# EAGLE design GatorParticle (EAGLE 9.1.0)
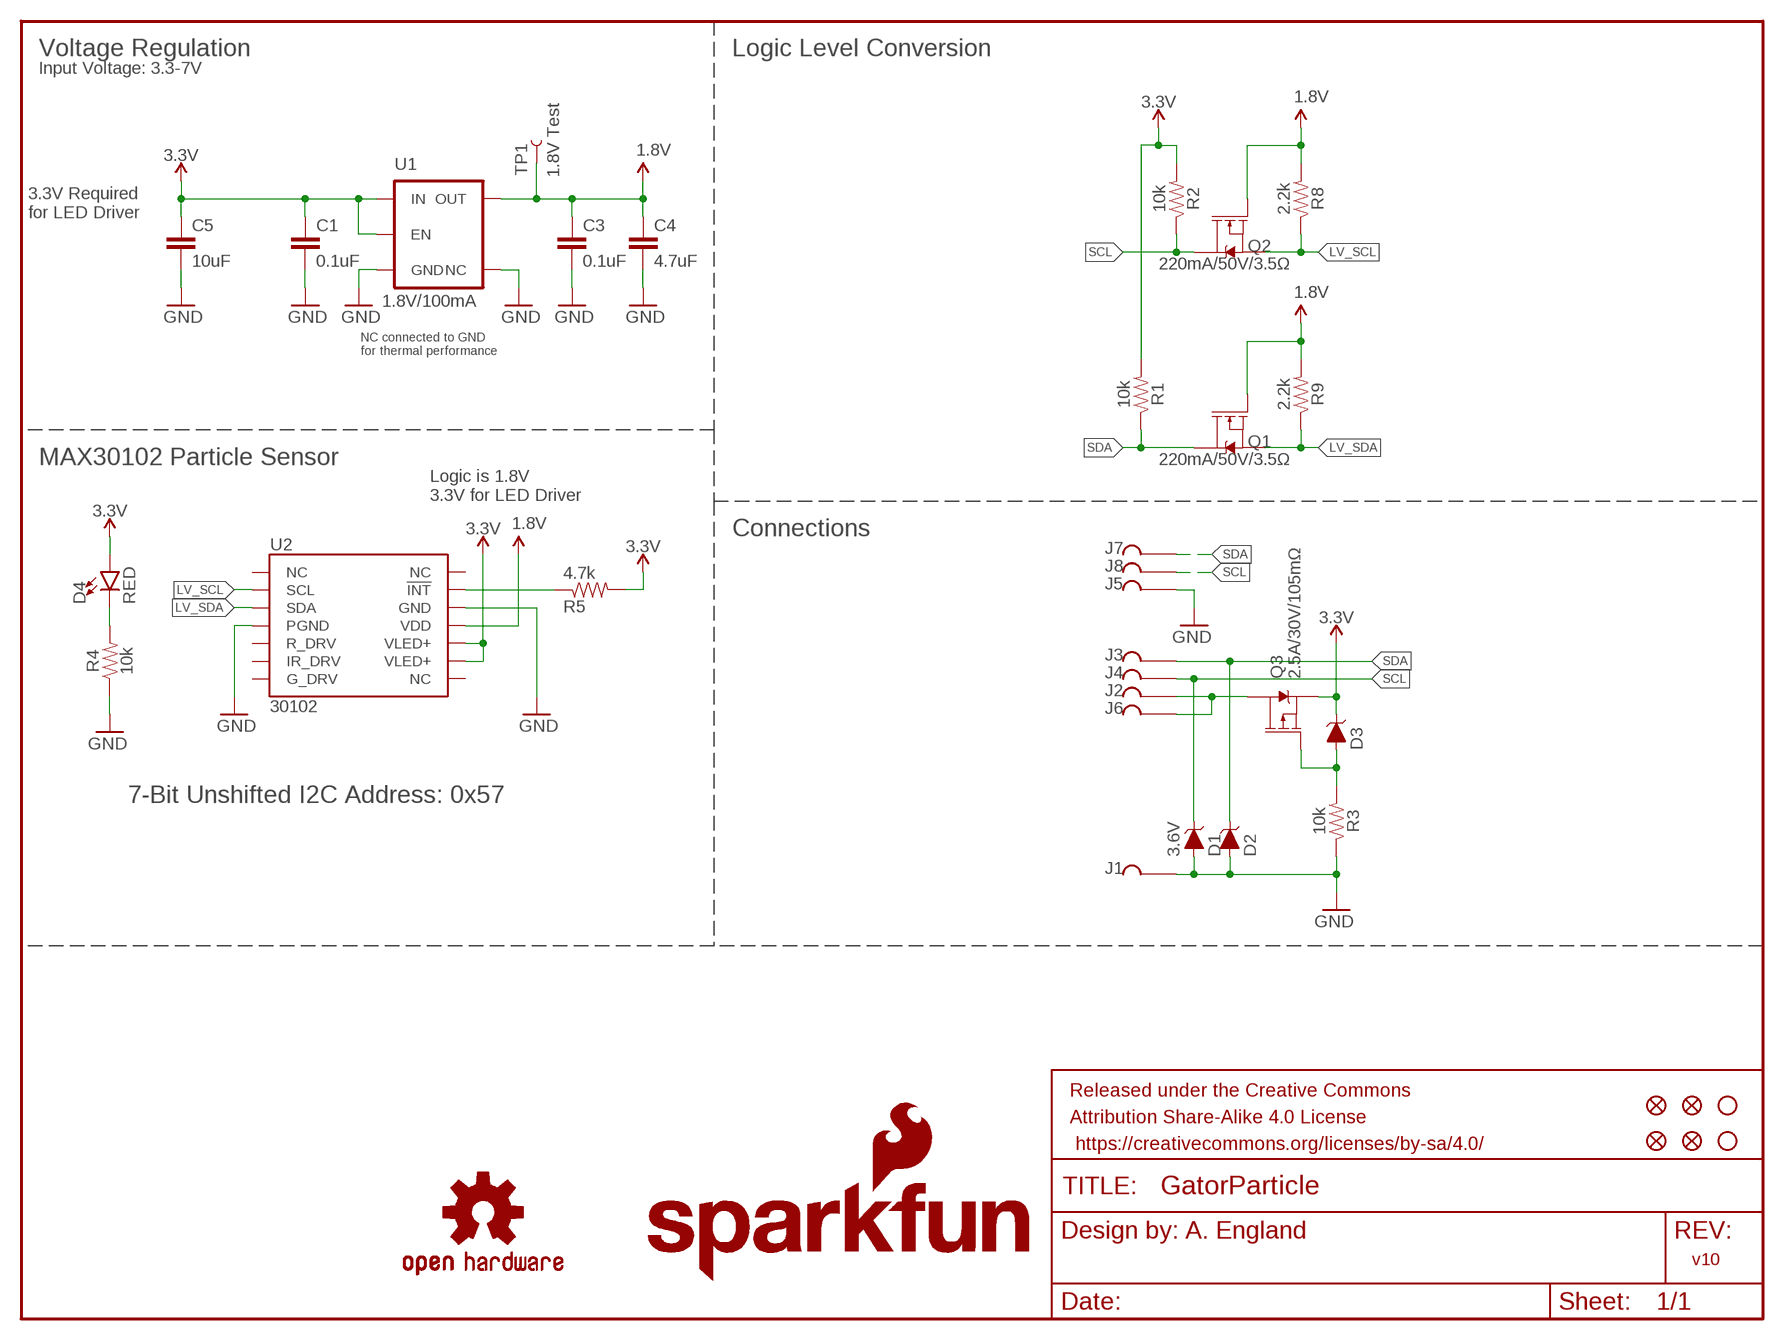
[diagram p0: schematic, sheet 1]

## Parts
C1  0.1uF  0.1UF-0603-25V-(+80/-20%)  [0603]
C3  0.1uF  0.1UF-0603-25V-(+80/-20%)  [0603]
C4  4.7uF  4.7UF-0603-6.3V-(10%)  [0603]
C5  10uF  10UF-0603-6.3V-20%  [0603]
D1  3.6V  DIODE-ZENER-BZT52C3V6S  [SOD-323]
D2  3.6V  DIODE-ZENER-BZT52C3V6S  [SOD-323]
D3  3.6V  DIODE-ZENER-BZT52C3V6S  [SOD-323]
D4  RED  LED-RED0603  [LED-0603]
FID1  FIDUCIALUFIDUCIAL  [FIDUCIAL-MICRO]
FID2  FIDUCIALUFIDUCIAL  [FIDUCIAL-MICRO]
FID3  FIDUCIALUFIDUCIAL  [FIDUCIAL-MICRO]
FID4  FIDUCIALUFIDUCIAL  [FIDUCIAL-MICRO]
FRAME1  FRAME-LETTER  [CREATIVE_COMMONS]
J1  GATORGATOR_MINI  [GATOR_MINI]
J2  GATORGATOR_MINI  [GATOR_MINI]
J3  GATORGATOR_MINI  [GATOR_MINI]
J4  GATORGATOR_MINI  [GATOR_MINI]
J5  GATORGATOR_MINI  [GATOR_MINI]
J6  GATORGATOR_MINI  [GATOR_MINI]
J7  GATORGATOR_MINI  [GATOR_MINI]
J8  GATORGATOR_MINI  [GATOR_MINI]
LOGO1  SFE_LOGO_NAME_FLAME.1_INCH  [SFE_LOGO_NAME_FLAME_.1]
LOGO2  OSHW-LOGOS  [OSHW-LOGO-S]
Q1  220mA/50V/3.5Ω  MOSFET-NCH-BSS138  [SOT23-3]
Q2  220mA/50V/3.5Ω  MOSFET-NCH-BSS138  [SOT23-3]
Q3  2.5A/30V/105mΩ  MOSFET_PCH-DMG2307L  [SOT23-3]
R1  10k  10KOHM-0603-1/10W-1%  [0603]
R2  10k  10KOHM-0603-1/10W-1%  [0603]
R3  10k  10KOHM-0603-1/10W-1%  [0603]
R4  10k  10KOHM-0603-1/10W-1%  [0603]
R5  4.7k  4.7KOHM-0603-1/10W-1%  [0603]
R8  2.2k  2.2KOHM-0603-1/10W-1%  [0603]
R9  2.2k  2.2KOHM-0603-1/10W-1%  [0603]
STANDOFF2  STAND-OFFTIGHT  [STAND-OFF-TIGHT]
STANDOFF3  STAND-OFFTIGHT  [STAND-OFF-TIGHT]
TP1  1.8V Test  TEST-POINT3X4  [PAD.03X.04]
U1  1.8V/100mA  V_REG_SP6214-1.8V  [SC70]
U2  30102  MAX3010X-30102  [OLGA-14]

## Nets
1.8V: C3.1 C4.1 Q1.1(G) Q2.1(G) R8.2 R9.2 TP1.P$1 U1.5(OUT) U2.11(VDD)
3.3V: C1.1 C5.1 D3.C D4.A Q3.2(S) R1.2 R2.2 R5.2 U1.1(IN) U1.3(EN) U2.9(VLED+) U2.10(VLED+)
!INT: R5.1 U2.13(!INT)
GND [power]: C1.2 C3.2 C4.2 C5.2 D1.A D2.A J1.P$2 J5.P$2 R3.1 R4.1 U1.2(GND) U1.4(NC) U2.4(PGND) U2.12(GND)
LV_SCL: Q2.2(S) R8.1 U2.2(SCL)
LV_SDA: Q1.2(S) R9.1 U2.3(SDA)
N$1 [power]: D3.A Q3.1(G) R3.2
N$2: J2.P$2 J6.P$2 Q3.3(D)
N$3: D4.C R4.2
SCL: D1.C J4.P$2 J8.P$2 Q2.3(D) R2.1
SDA: D2.C J3.P$2 J7.P$2 Q1.3(D) R1.1
Unconnected: U2.1(NC) U2.5(R_DRV) U2.6(IR_DRV) U2.7(G_DRV) U2.8(NC) U2.14(NC)

## Notes on the sheet
- Voltage Regulation | Logic Level Conversion
- Input Voltage: 3.3-7V
- 3.3V Required
  for LED Driver
- NC connected to GND
  for thermal performance
- MAX30102 Particle Sensor
- Logic is 1.8V
  3.3V for LED Driver
- Connections
- 7-Bit Unshifted I2C Address: 0x57
- A. England
- v10

## Library data of the parts
C1 C3 = SparkFun-Capacitors:0.1UF: 0.1µF ceramic capacitors A capacitor is a passive two-terminal electrical component used to store electrical energy temporarily in an electric field.; PROD_ID: CAP-00810
C4 = SparkFun-Capacitors:4.7UF: 4.7µF ceramic capacitors A capacitor is a passive two-terminal electrical component used to store electrical energy temporarily in an electric field.; PROD_ID: CAP-08280
C5 = SparkFun-Capacitors:10UF: 10.0µF ceramic capacitors A capacitor is a passive two-terminal electrical component used to store electrical energy temporarily in an electric field.; PROD_ID: CAP-11015
D1-D3 = SparkFun-DiscreteSemi:DIODE-ZENER: Zener Diode A Zener diode allows current to flow from its anode to its cathode like a normal semiconductor diode, but it also permits current to flow in the reverse direction when its "Zener voltage" is reached. - WIkipedia; PROD_ID: DIO-08199
D4 = SparkFun-LED:LED-RED: Red SMD LED Used in manufacturing of most products at SparkFun Packages: 0603 - SMD 0603 package [Product Link] <http://docs.avagotech.com/docs/AV02-0551EN> 0603 SMART - SMD 0603 SMART package ( more efficient and expensive)[Product Link] <http://www.osram-os.com/Graphics/XPic2/00077099_0.pdf> 1206 - SMD1206 package [Product Link] <https://www.sparkfun.com/datasheets/DevTools/LilyPad/Q150OVS4.pdff> SparkFun Products: Pro Mini 328 -5V <https://www.sparkfun.com/products/821> RedBoard <https://www.sparkfun.com/products/12757> IOIO-OTG <https://www.sparkfun.com/products/13613>; PROD_ID: DIO-00819
FID1-FID4 = SparkFun-Aesthetics:FIDUCIAL: Fiducial Alignment Points Point-of-reference for pick-and-place machines and other optical instruments.
FRAME1 = SparkFun-Aesthetics:FRAME-LETTER: Schematic Frame - Letter Standard 8.5x11 US Letter frame
J1-J8 = SparkFun-Connectors:GATOR
LOGO1 = SparkFun-Aesthetics:SFE_LOGO_NAME_FLAME: SparkFun Font Logo w/ Flame This is the SparkFun full logo. The logo on the schematic will always be the same size; the package variant is the height of the flame part of the logo. Default layer for the logo on the board is tSilk.
LOGO2 = SparkFun-Aesthetics:OSHW-LOGO: Open-Source Hardware (OSHW) Logo This logo indicates the piece of hardware it is found on incorporates a OSHW license and/or adheres to the definition of open source hardware found here: http://freedomdefined.org/OSHW
Q1 Q2 = SparkFun-DiscreteSemi:MOSFET-NCH: N-channel MOSFETs Voltage controlled devices that allow control of high current outputs. SparkFun Products: SparkFun OpenScale <https://www.sparkfun.com/products/13261> SparkFun Digital Sandbox <https://www.sparkfun.com/products/12651> SparkFun Monster Moto Shield <https://www.sparkfun.com/products/10182> SparkFun MOSFET Power Controller <https://www.sparkfun.com/products/11214>; PROD_ID: TRANS-00830
Q3 = SparkFun-DiscreteSemi:MOSFET_PCH: P-channel MOSFETs Voltage controlled devices that allow control of high current outputs. SparkFun Products: SparkFun ESP32 Thing <https://www.sparkfun.com/products/13907> SparkFun ESP8266 Thing <https://www.sparkfun.com/products/13231>; PROD_ID: TRANS-11308
R1-R4 = SparkFun-Resistors:10KOHM: 10kΩ resistor A resistor is a passive two-terminal electrical component that implements electrical resistance as a circuit element. Resistors act to reduce current flow, and, at the same time, act to lower voltage levels within circuits. - Wikipedia; PROD_ID: RES-00824
R5 = SparkFun-Resistors:4.7KOHM: 4.7kΩ resistor A resistor is a passive two-terminal electrical component that implements electrical resistance as a circuit element. Resistors act to reduce current flow, and, at the same time, act to lower voltage levels within circuits. - Wikipedia; PROD_ID: RES-07857
R8 R9 = SparkFun-Resistors:2.2KOHM: 2.2kΩ resistor A resistor is a passive two-terminal electrical component that implements electrical resistance as a circuit element. Resistors act to reduce current flow, and, at the same time, act to lower voltage levels within circuits. - Wikipedia; PROD_ID: RES-08272
STANDOFF2 STANDOFF3 = SparkFun-Hardware:STAND-OFF: Stand Off Drill holes for mechanically mounting via screws, standoffs, etc. Note: Use the keepout ring to avoid running the screw head into surrounding components. Variant Overviews STAND-OFF - Mechanical footprint for a #4 phillips button head screw. STAND-OFF-TIGHT - Mechanical footprint for a #4 phillips button head screw, Example SparkFun Products Screw - Phillips Head (1/4", 4-40, 10 pack) <https://www.sparkfun.com/products/10453> (PRT-10453) Screw - Phillips Head (1/2", 4-40, 10 pack) <https://www.sparkfun.com/products/10452> (PRT-10452) Screw - Phillips Head (3/4", 4-40, 10 pack) <https://www.sparkfun.com/products/10451> (PRT-10451) Screw - Phillips Head (1", 4-40, 10 pack) <https://www.sparkfun.com/products/10450> (PRT-10450)
TP1 = SparkFun-Passives:TEST-POINT: Bare copper test points for troubleshooting or ICT
U1 = SparkFun-IC-Power:V_REG_SP6214: Voltage Regulator - SP6214 SP6214 Series SC-70-5 Micropower SC-70 100 mA CMOS LDO Regulator Datasheet <https://www.exar.com/content/document.ashx?id=654> SparkFun Products: MP3 Trigger <https://www.sparkfun.com/products/13720> SparkFun Particle Sensor Breakout <https://www.sparkfun.com/products/14045>; PROD_ID: VREG-08428
U2 = SparkFun-Sensors:MAX3010X: MAX30105 High Sensitivity Optical Sensor Can be used for Pulse Detection, Pulse Ox, and possible visual particle detection. I2C communication. Datasheet <https://datasheets.maximintegrated.com/en/ds/MAX30105.pdf> SparkFun Products: SparkFun Particle Sensor Breakout - MAX30105 <https://www.sparkfun.com/products/14045>; PROD_ID: IC-14316

## Net classes
1 power: width 0.203 mm

## Board
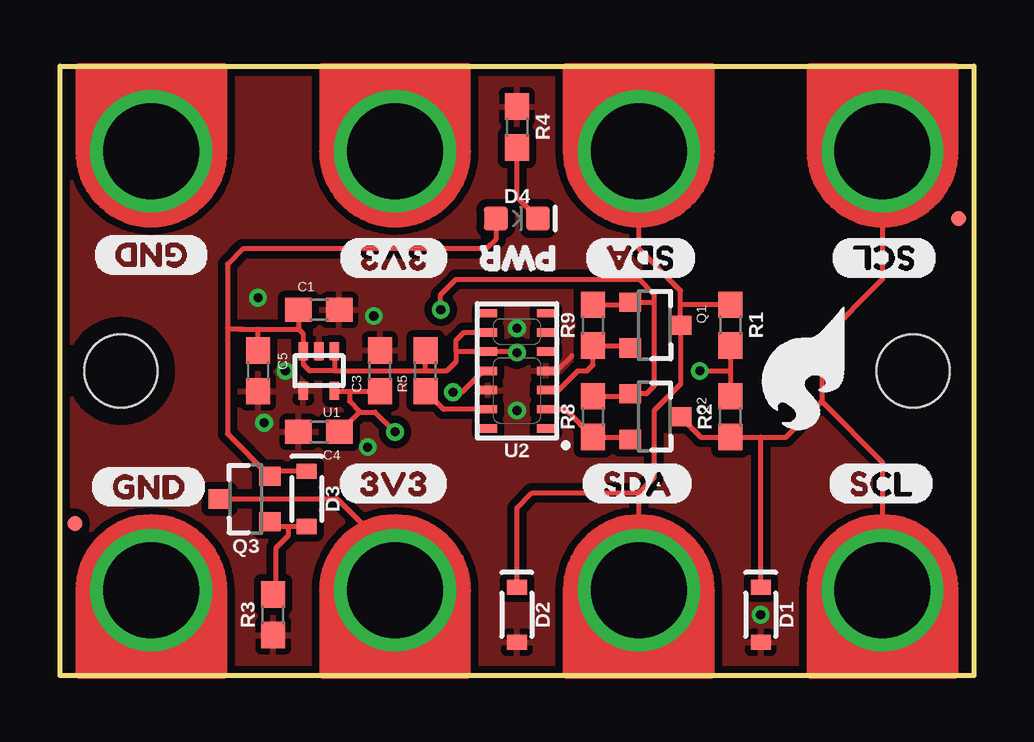
[diagram p1: board, top side]
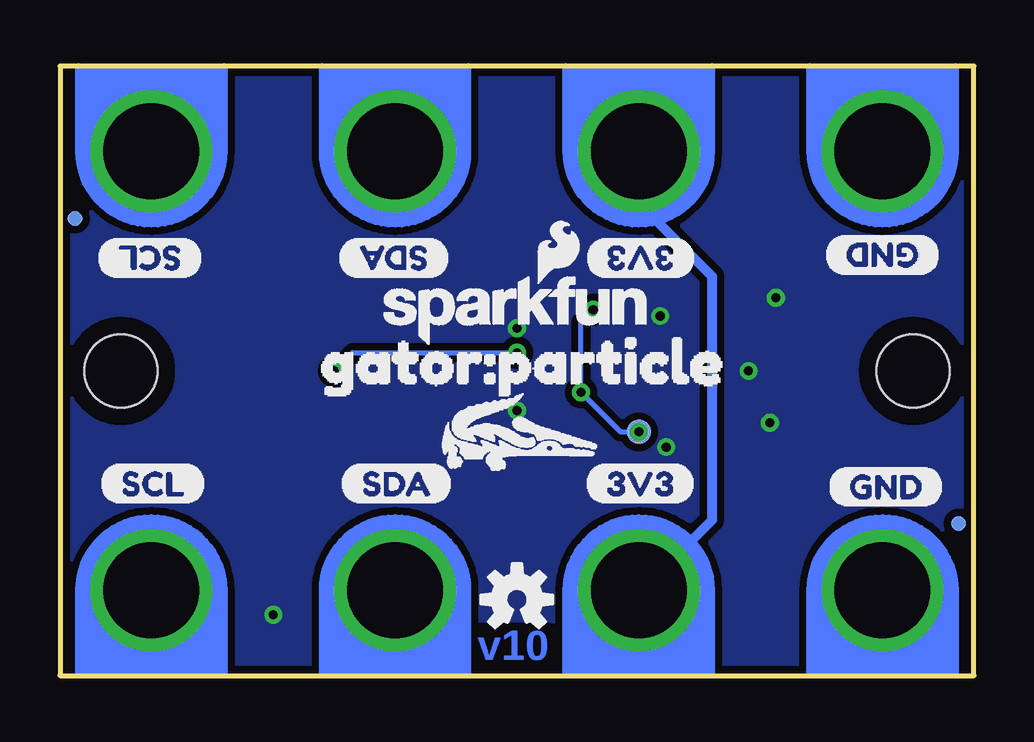
[diagram p2: board, bottom side, seen from below]

Size 38.1 x 25.4 mm. Coordinates in mm from the lower left corner, seen from the top.
Outline: 38.1,0 0,0 0,25.4 38.1,25.4 38.1,0
Copper layers (1*16): Top 0.035mm / dielectric 1.5mm / Bottom 0.035mm
Design rules "SparkFun-2-layer-TIGHT": minimum track width 7mil, minimum drill 15mil, track to track 7mil, track to pad 7mil, pad to pad 7mil, via to via 7mil, smd to smd 7mil, copper to edge 7mil, drill to drill 7mil, minimum pad ring 7mil, minimum via ring 7mil, stop-mask expansion 4mil, vias tented up to drill 25mil, thermal gap 10mil

### Footprints (pad centres in the part's own frame; a part is rotated, then mirrored left to right if it is on the bottom)
0603 = smd 1.1 x 1: 1 -0.85,0; 2 0.85,0
SOD-323 = smd 0.63 x 0.83: A 1.15,0; C -1.15,0
LED-0603 = smd 1 x 1: A -0.877,0; C 0.877,0
FIDUCIAL-MICRO = smd 0.635 x 0.635: 1 0,0
GATOR_MINI = drill 4 pad 5.08: P$2 0,-0.254
SOT23-3 = smd 0.8 x 0.9: 1 -0.95,-1; 2 0.95,-1; 3 0,1.1
STAND-OFF-TIGHT = hole 3.048: 0,0
PAD.03X.04 = smd 1.016 x 1.016: P$1 0,0
SC70 = smd 0.4 x 0.75: 1 -0.65,-0.825; 2 0,-0.825; 3 0.65,-0.825; 4 0.65,0.825; 5 -0.65,0.825
OLGA-14 = smd 0.75 x 0.35: 1 -1.2,2.4; 2 -1.2,1.6; 3 -1.2,0.8; 4 -1.2,0; 5 -1.2,-0.8; 6 -1.2,-1.6; 7 -1.2,-2.4; 8 1.2,-2.4; 9 1.2,-1.6; 10 1.2,-0.8; 11 1.2,0; 12 1.2,0.8; 13 1.2,1.6; 14 1.2,2.4

### Placement (x,y rotation side)
C1  10.79,15.24 0 top
C3  13.34,12.7 90 top
C4  10.79,10.16 180 top
C5  8.26,12.7 270 top
D1  29.21,2.54 270 top
D2  19.05,2.54 270 top
D3  10.29,7.37 270 top
D4  19.05,19.05 0 top
FID1  37.47,19.05 0 top
FID2  0.64,6.35 0 bottom
FID3  0.64,6.35 0 top
FID4  37.47,19.05 0 bottom
FRAME1  -2.54,-16.51 0 top  (outside the outline)
J1  3.81,3.81 0 top
J2  13.97,3.81 0 top
J3  24.13,3.81 0 top
J4  34.29,21.59 180 top
J5  3.81,21.59 180 top
J6  13.97,21.59 180 top
J7  24.13,21.59 180 top
J8  34.29,3.81 0 top
LOGO1  19.05,15.24 0 bottom
LOGO2  19.05,3.17 0 bottom
Q1  24.77,14.61 270 top
Q2  24.77,10.79 270 top
Q3  7.75,7.37 90 top
R1  27.94,14.61 270 top
R2  27.94,10.79 90 top
R3  8.89,2.54 90 top
R4  19.05,22.86 270 top
R5  15.24,12.7 90 top
R8  22.23,10.79 90 top
R9  22.23,14.61 90 top
STANDOFF2  35.56,12.7 0 top
STANDOFF3  2.54,12.7 0 top
TP1  13.97,10.16 0 bottom
U1  10.79,12.7 180 top
U2  19.05,12.7 180 top
U$1  [GND0]  1.27,7.87 0 top
U$2  [3V33]  11.56,8 0 top
U$3  [SDA2]  21.72,8 0 top
U$4  [SCL1]  32,8 0 top
U$5  [GND0]  1.4,17.53 180 bottom
U$6  [3V33]  11.56,17.4 180 bottom
U$7  [SDA2]  21.84,17.4 180 bottom
U$8  [SCL1]  32.13,17.4 180 bottom
U$9  [GND0]  6.22,17.53 180 top
U$10  [3V33]  16.26,17.4 180 top
U$11  [SDA2]  26.54,17.4 180 top
U$12  [SCL1]  36.58,17.4 180 top
U$13  [GND0]  6.1,7.87 0 bottom
U$14  [3V33]  16.26,8 0 bottom
U$15  [SDA2]  26.42,8 0 bottom
U$16  [SCL1]  36.45,8 0 bottom
U$17  [SFE_LOGO_FLAME_.2]  30.99,12.83 180 top
U$18  [ORDERING_INSTRUCTIONS]  -8.89,-20.32 0 top  (outside the outline)
U$19  [PWR0]  21.59,17.4 180 top
U$21  [GATORBIT_FINAL_FOR_SILK#01#PNG]  18.92,10.16 0 bottom
U$22  [GATOR#PARTICLE0]  28.83,13.08 0 bottom

### Tracks (layer width: path | path; a pad name or v marks a point on that pad's centre or on a via)
1.8V  (via drill 0.38)
  Top 0.203: U2.11 17.65,12.7 16.76,11.81 v16.38,11.81 | U1.5 11.47,11.85 12.06,11.85 | 12.06,11.85 C3.1 | 12.06,11.85 12.06,11.43 12.51,10.99 | TP1.P$1 13.14,10.99 12.51,10.99 | C4.1 12.47,10.99 12.51,10.99 | R9.2 23.66,15.46 Q1.1 24.7,15.55 24.77,15.49 | R8.2 23.66,11.64 Q2.1 24.45,11.74 24.77,12.06 24.77,15.24 24.77,15.49 | v15.87,15.25 15.87,15.87 16.51,16.51 24.13,16.51 24.77,15.88 24.77,15.49
  Bottom 0.203: TP1.P$1 14.73,10.16 v16.38,11.81 16.38,14.74 v15.87,15.25
  other vias: 13.97,10.16
3.3V  (via drill 0.38)
  Top 0.203: 9.95,14.44 10.14,14.24 U1.3 10.14,12.97 10.41,12.7 11.43,12.7 11.45,12.71 | U1.1 11.45,12.71 | 16.51,13.5 U2.10 18.89,13.5 18.92,13.46 v19.05,13.46 | 16.51,13.5 16.51,13.97 16.84,14.3 U2.9 | 11.45,12.71 15.24,12.71 | 15.24,12.71 16.14,12.71 16.51,13.08 16.51,13.5 | C1.1 9.95,14.44 | R1.2 27.94,12.7 | 27.94,12.7 R2.2 | v26.67,12.7 27.94,12.7 | 7.62,14.44 8.26,14.44 | 8.26,14.44 9.95,14.44 | C5.1 8.26,14.44 | D3.C 8.95,8.52 Q3.2 6.99,10.08 6.99,13.97 | D4.A 18.17,18.17 17.78,17.78 7.62,17.78 6.99,17.14 6.99,14.48 | 6.99,14.48 6.99,13.97 | 7.62,14.44 7.45,14.44 7.62,14.44 | 6.99,13.97 | 7.62,14.44 7.02,14.44 6.99,14.48 | 15.24,12.71 R5.2
  Bottom 0.203: v26.67,12.7 25.91,13.46 v19.05,13.46
!INT
  Top 0.203: U2.13 15.99,11.1 R5.1
GND  (via drill 0.38)
  Top 0.203: U2.4 20.7,12.7 21.34,13.34
  other vias: 9.4,12.7 13.08,14.99 19.05,11.05 8.51,10.54 19.05,14.48 29.21,2.54 12.83,9.53 8.26,15.75
  pour Top (isolate 0.305, rank 6): 38.1,25.4 0,25.4 0,0 38.1,0
  pour Bottom (isolate 0.305, rank 6): 38.1,25.4 0,25.4 0,0 38.1,0
LV_SCL
  Top 0.203: Q2.2 23.66,9.95 R8.1 21.07,11.1 U2.2
LV_SDA
  Top 0.203: Q1.2 23.66,13.76 R9.1 22.23,12.95 | 21.97,12.7 21.59,12.7 20.79,11.9 U2.3 | 21.97,12.7 22.23,12.95 | 21.97,12.7 22.23,12.95
N$1
  Top 0.203: D3.A 9.53,6.22 | 9.53,6.22 8.95,6.22 Q3.1 | 9.53,6.22 9.53,5.84 9.02,5.33 9.02,3.52 R3.2
N$2
  Top 0.203: Q3.3 11.56,7.37 13.97,4.95 J2.P$2
  Bottom 0.203: J6.P$2 13.97,19.68 | 13.84,3.56 J2.P$2
  Bottom 0.406: 13.97,19.68 10.92,16.64 10.92,6.48 13.84,3.56
N$3
  Top 0.203: D4.C 19.05,19.93 R4.2
SCL
  Top 0.203: Q2.3 26.71,9.95 R2.1 29.21,9.95 | J4.P$2 34.29,16.51 31.75,13.97 31.75,11.43 | 31.75,11.43 34.29,8.89 J8.P$2 | 29.21,9.95 30.27,9.95 31.75,11.43 | D1.C 29.21,9.95
SDA
  Top 0.203: 25.86,15.49 Q1.3 25.86,12.15 24.77,11.05 24.77,8.26 24.13,7.62 | 25.86,15.49 25.86,16.05 24.13,17.78 J7.P$2 | 25.86,15.49 25.9,15.46 R1.1 | D2.C 19.05,6.99 19.68,7.62 24.13,7.62 | J3.P$2 24.13,7.62

### Text on the board
Bottom: v10
Measures: All Dimensions in Inches
tDocu: A. England | Black Gloss Soldermask